# Altium schematic sheet 04.SchDoc
size 297 x 209 mm
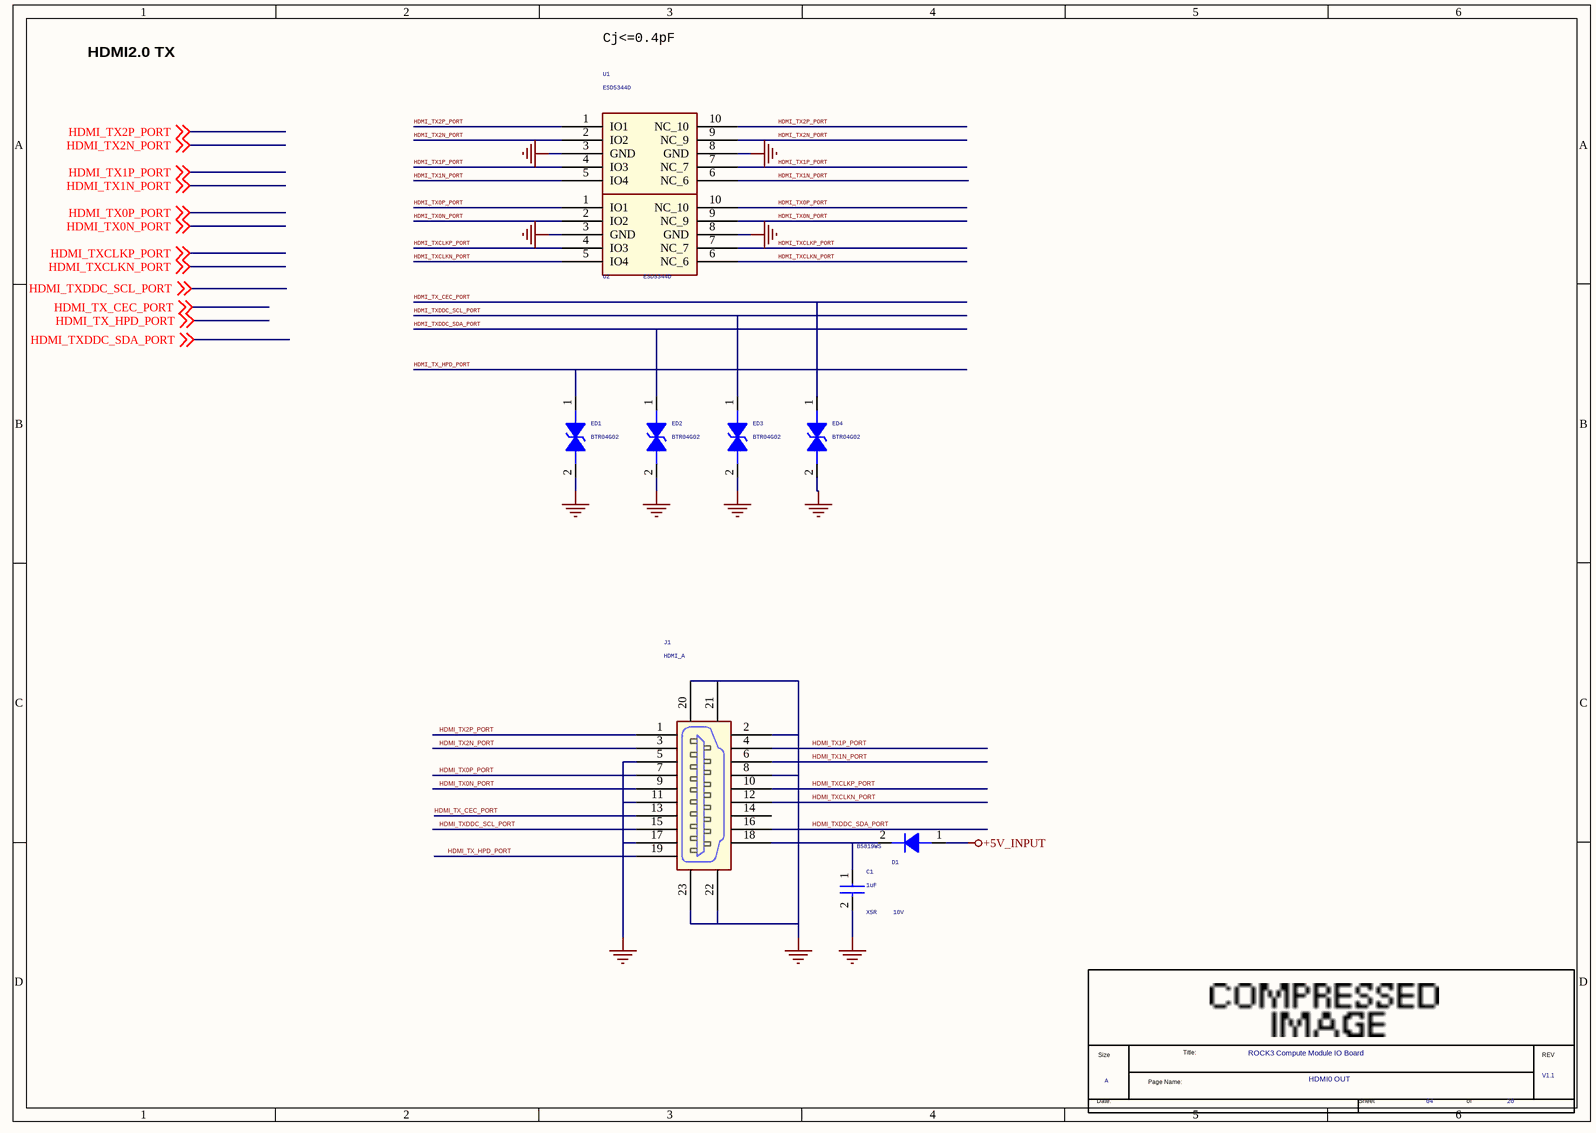
[diagram p0: 04.SchDoc]

## Parts
*  Page Count: 20  Page Number: 04  Page Size: A  Title: ROCK3 Compute Module IO Board  RevCode: V1.1  Doc: HDMI0 OUT  (hidden comment: radxa_gong)  (graphical)
C1  1uF  Voltage: 10V  Dielectric: X5R  [C0402]
D1  B5819WS  [SOD_323]
ED1  BTR04G02  [ESD0402_1xD5]
ED2  BTR04G02  [ESD0402_1xD5]
ED3  BTR04G02  [ESD0402_1xD5]
ED4  BTR04G02  [ESD0402_1xD5]
J1  HDMI_A  [HDMIA19S]
U1  ESD5344D  [SON10_2R50X1R00X0R50]
U2  ESD5344D  [SON10_2R50X1R00X0R50]

## Nets
+5V_INPUT: D1.1(A)
GND: C1.2 ED1.2 ED2.2 ED3.2 ED4.2 J1.2 J1.5 J1.8 J1.11 J1.17 J1.20 J1.21 J1.22 J1.23 U1.3(GND) U1.8(GND) U2.3(GND) U2.8(GND)
HDMI_TX0N_PORT: J1.9 U2.2(IO2) U2.9(NC_9) ; off-sheet HDMI_TX0N_PORT
HDMI_TX0P_PORT: J1.7 U2.1(IO1) U2.10(NC_10) ; off-sheet HDMI_TX0P_PORT
HDMI_TX1N_PORT: J1.6 U1.5(IO4) U1.6(NC_6) ; off-sheet HDMI_TX1N_PORT
HDMI_TX1P_PORT: J1.4 U1.4(IO3) U1.7(NC_7) ; off-sheet HDMI_TX1P_PORT
HDMI_TX2N_PORT: J1.3 U1.2(IO2) U1.9(NC_9) ; off-sheet HDMI_TX2N_PORT
HDMI_TX2P_PORT: J1.1($PIN0) U1.1(IO1) U1.10(NC_10) ; off-sheet HDMI_TX2P_PORT
HDMI_TX_CEC_PORT: ED4.1 J1.13 ; off-sheet HDMI_TX_CEC_PORT
HDMI_TX_HPD_PORT: ED1.1 J1.19 ; off-sheet HDMI_TX_HPD_PORT
HDMI_TXCLKN_PORT: J1.12 U2.5(IO4) U2.6(NC_6) ; off-sheet HDMI_TXCLKN_PORT
HDMI_TXCLKP_PORT: J1.10 U2.4(IO3) U2.7(NC_7) ; off-sheet HDMI_TXCLKP_PORT
HDMI_TXDDC_SCL_PORT: ED3.1 J1.15 ; off-sheet HDMI_TXDDC_SCL_PORT
HDMI_TXDDC_SDA_PORT: ED2.1 J1.16 ; off-sheet HDMI_TXDDC_SDA_PORT
NetC1_1: C1.1 D1.2(K) J1.18

Not connected (* = marked no-connect by the designer): J1 14

## Notes on the sheet
- HDMI2.0 TX
- Cj<=0.4pF
- (in symbol radxa_gong) Size; Title:; REV; Page Name:; Date:; Sheet; of

## Library data of the parts
C1 = CAP NP_Dup2: cap,1.00uF,+/-10%,10V,X5R,C0402; Manufacturer PN: C1005X5R1A105K050BB; Manufacturer: TDK; Tolerance: 10%; Priority: A; Created by: JJJ; Part Type: C0402; RK PN: C1005X5R1A105K050BB
D1 = DIODE_Dup2: Schottky Barrier，B5819WS SOD-323; Manufacturer: 长电; Priority: A; RK PN: B5819WS; Part Type: Schottky rectifier; Manufacturer PN: B5819WS; Created by: JJJ
ED1-ED4 = DIODE BI_DIR TRIG: 1-Line, Bi-directional, Transient Voltage Suppressors.17.5pF.; Manufacturer: WillSemi(韦尔半导体); RK PN: ESD5451N; Priority: A; Part Type: ESD_TVS; Manufacturer PN: ESD5451N; Created by: JJJ
J1 = HDMI_A: 通用A型HDMI座,卧式,侧插; Manufacturer: 旺科达; Priority: A; RK PN: HDMI_A; Part Type: HDMI Jack; Manufacturer Part Number: HDMI_A; Created by: JJJ
U1 U2 = ESD_ESD5304D: 4-Lines, Uni-directional, Ultra-low Capacitance Transient Voltage Suppressors; Manufacturer: WillSemi(韦尔半导体); Priority: A; Created by: JJJ; Manufacturer PN: ESD5304D; Part Type: ESD_TVS; RK PN: ESD5304D
* = radxa_gong: Page Create Date: March  8, 1995